# EAGLE design currentmeterProject2 (EAGLE 7.6.0)

## Sheet 1 of 2
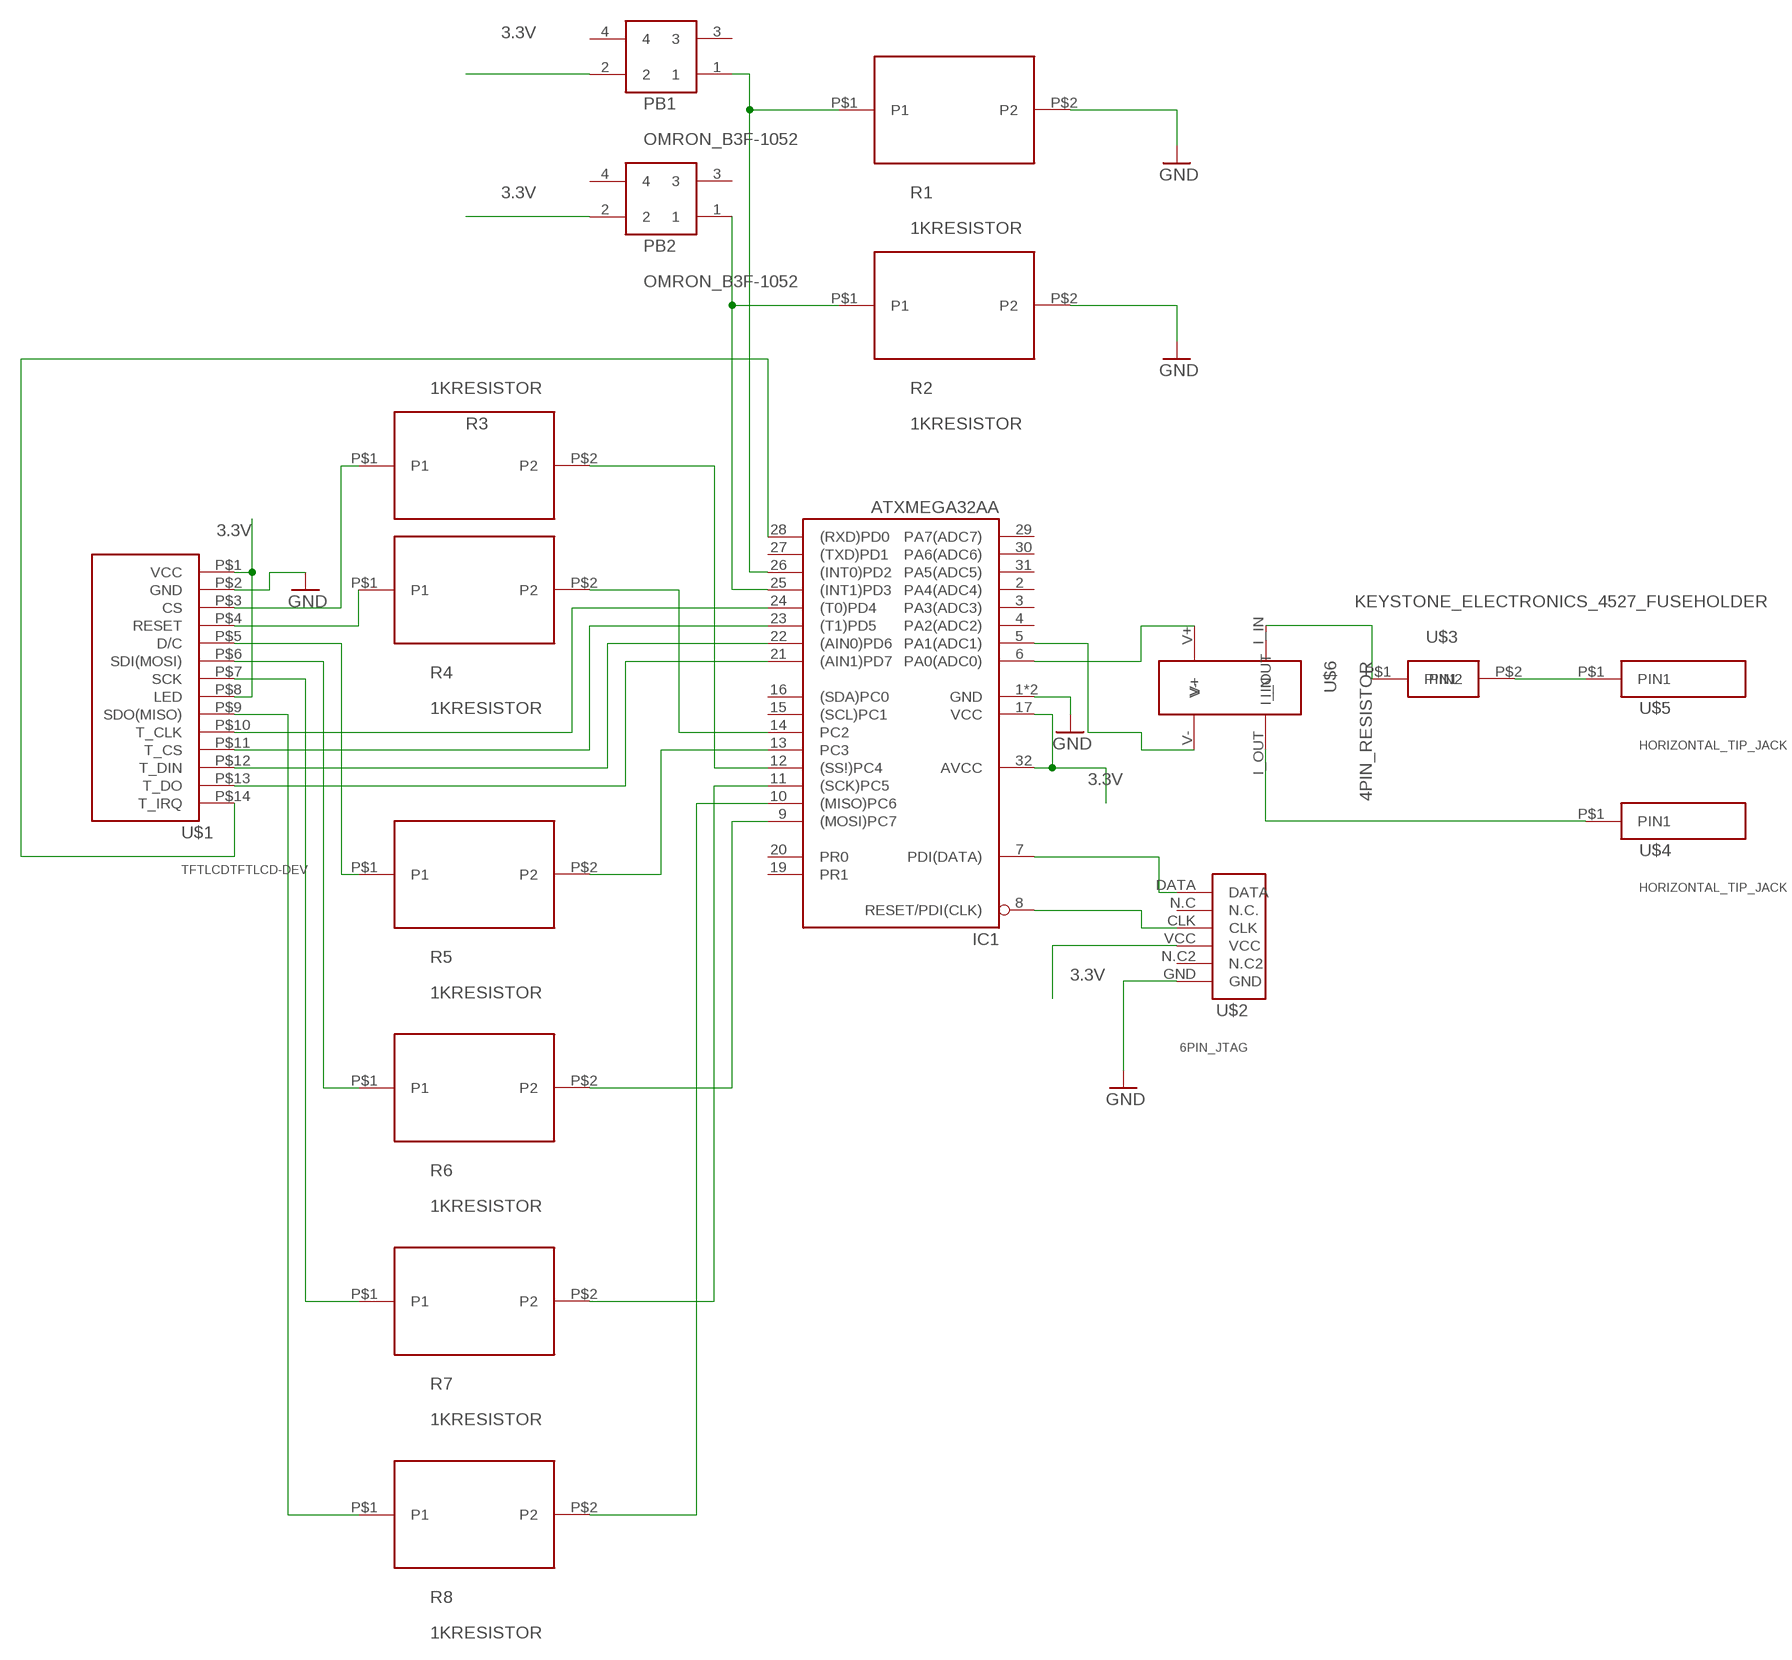
[diagram p0: schematic, sheet 1]

### Parts
IC1  ATXMEGA32AA  [TQFP32-08]
PB1  OMRON_B3F-1052  [OMRON_B3F-1052]
PB2  OMRON_B3F-1052  [OMRON_B3F-1052]
R1  1KRESISTOR  [1KRESISTOR]
R2  1KRESISTOR  [1KRESISTOR]
R3  1KRESISTOR  [1KRESISTOR]
R4  1KRESISTOR  [1KRESISTOR]
R5  1KRESISTOR  [1KRESISTOR]
R6  1KRESISTOR  [1KRESISTOR]
R7  1KRESISTOR  [1KRESISTOR]
R8  1KRESISTOR  [1KRESISTOR]
U$1  TFTLCDTFTLCD-DEV  [TFTLCDTFTLCD-DEV]
U$2  6PIN_JTAG  [6PIN_JTAG]
U$3  KEYSTONE_ELECTRONICS_4527_FUSEHOLDER  [KEYSTONE_ELECTRONICS_4527_FUSEHOLDER]
U$4  HORIZONTAL_TIP_JACK  [HORIZONTAL_TIP_JACK]
U$5  HORIZONTAL_TIP_JACK  [HORIZONTAL_TIP_JACK]
U$6  4PIN_RESISTOR  [4PIN_RESISTOR]

### Nets
3.3V: IC1.17(VCC) IC1.32(AVCC) PB1.2 PB2.2 U$1.P$1(VCC) U$1.P$8(LED) U$2.VCC ; also sheet 2
GND: IC1.1(GND) IC1.18(GND) R1.P$2(P2) R2.P$2(P2) U$1.P$2(GND) U$2.GND ; also sheet 2
N$1: IC1.5(PA1(ADC1)) U$6.V-
N$2: IC1.6(PA0(ADC0)) U$6.V+
N$3: U$3.P$1(PIN1) U$6.I_IN
N$4: U$3.P$2(PIN2) U$5.P$1(PIN1)
N$5: U$4.P$1(PIN1) U$6.I_OUT
N$6: IC1.7(PDI(DATA)) U$2.DATA
N$7: IC1.8(RESET/PDI(CLK)) U$2.CLK
N$8: IC1.12((SS!)PC4) R3.P$2(P2)
N$9: IC1.28((RXD)PD0) U$1.P$14(T_IRQ)
N$10: IC1.14(PC2) R4.P$2(P2)
N$11: IC1.13(PC3) R5.P$2(P2)
N$12: IC1.9((MOSI)PC7) R6.P$2(P2)
N$13: IC1.11((SCK)PC5) R7.P$2(P2)
N$14: IC1.10((MISO)PC6) R8.P$2(P2)
N$15: R3.P$1(P1) U$1.P$3(CS)
N$16: R4.P$1(P1) U$1.P$4(RESET)
N$17: R5.P$1(P1) U$1.P$5(D/C)
N$18: R6.P$1(P1) U$1.P$6(SDI(MOSI))
N$19: R7.P$1(P1) U$1.P$7(SCK)
N$20: R8.P$1(P1) U$1.P$9(SDO(MISO))
N$21: IC1.24((T0)PD4) U$1.P$10(T_CLK)
N$22: IC1.23((T1)PD5) U$1.P$11(T_CS)
N$23: IC1.22((AIN0)PD6) U$1.P$12(T_DIN)
N$24: IC1.21((AIN1)PD7) U$1.P$13(T_DO)
N$25: IC1.25((INT1)PD3) PB2.1 R2.P$1(P1)
N$26: IC1.26((INT0)PD2) PB1.1 R1.P$1(P1)
Unconnected: IC1.2(PA4(ADC4)) IC1.3(PA3(ADC3)) IC1.4(PA2(ADC2)) IC1.15((SCL)PC1) IC1.16((SDA)PC0) IC1.19(PR1) IC1.20(PR0) IC1.27((TXD)PD1) IC1.29(PA7(ADC7)) IC1.30(PA6(ADC6)) IC1.31(PA5(ADC5)) PB1.3 PB1.4 PB2.3 PB2.4 U$2.N.C2 U$2.N.C(N.C.)

## Sheet 2 of 2
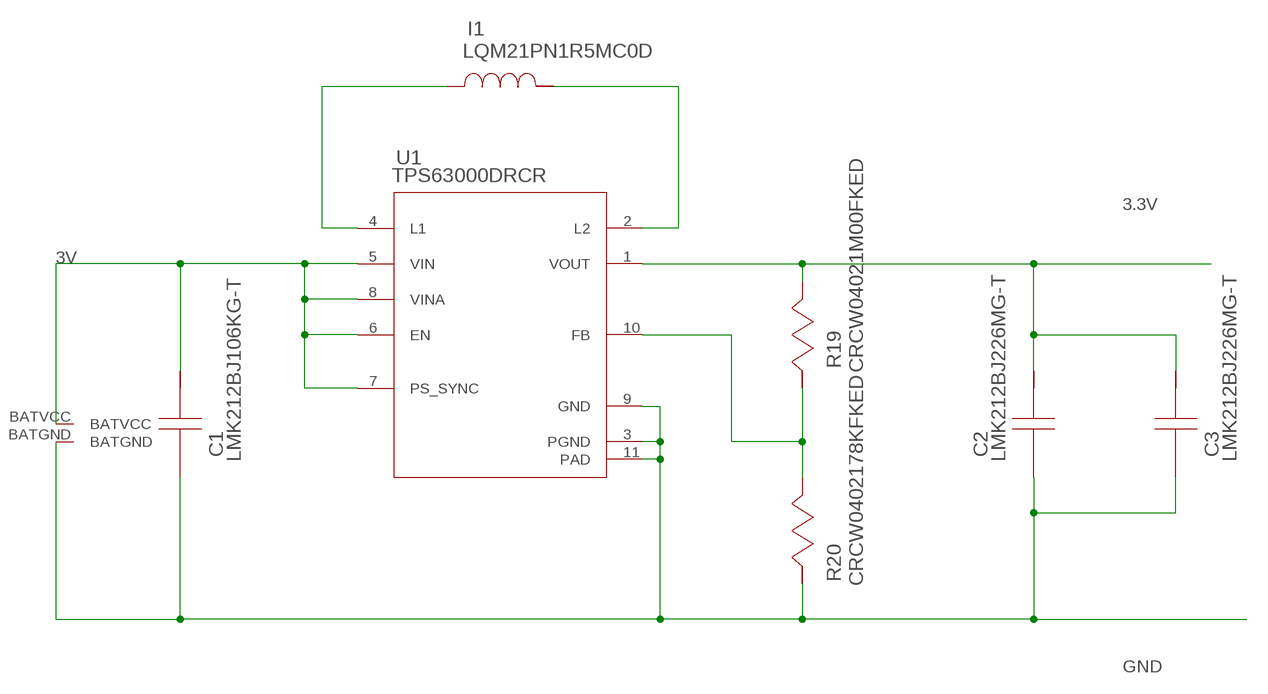
[diagram p1: schematic, sheet 2]

### Parts
C1  LMK212BJ106KG-T  [0805]
C2  LMK212BJ226MG-T  [0805]
C3  LMK212BJ226MG-T  [0805]
I1  LQM21PN1R5MC0D  [0805]
R19  CRCW04021M00FKED  [0402]
R20  CRCW0402178KFKED  [0402]
U1  TPS63000DRCR  [DRC0010J]
U$12  BATTERYHOLDER  [BATTERYHOLDER]

### Nets
3.3V: C2.1 C3.1 R19.1 U1.1(VOUT) ; also sheet 1
3V: C1.1 U1.5(VIN) U1.6(EN) U1.7(PS_SYNC) U1.8(VINA) U$12.BATVCC
GND: C1.2 C2.2 C3.2 R20.2 U1.3(PGND) U1.9(GND) U1.11(PAD) U$12.BATGND ; also sheet 1
N$56: I1.1 U1.4(L1)
N$57: I1.2 U1.2(L2)
N$58: R19.2 R20.1 U1.10(FB)

## Library data of the parts
C1 = 00ese323:LMK212BJ106KG-T; MANUFACTURER_NAME: Taiyo Yuden; VENDOR: Taiyo Yuden
C2 C3 = 00ese323:LMK212BJ226MG-T; MANUFACTURER_NAME: Taiyo Yuden; VENDOR: Taiyo Yuden
I1 = 00ese323:LQM21PN1R5MC0D; MANUFACTURER_NAME: MuRata; VENDOR: MuRata
IC1 = Tft_lcd_header:ATXMEGA32A: MICROCONTROLLER 2 Kbytes FLASH 128 bytes SRAM 128 bytes EEPROM UART 6-channel 10-bit ADC; OC_FARNELL: unknown; OC_NEWARK: unknown
PB1 PB2 = SPSTSwitch:OMRON_B3F-1052
R1-R8 = 1KRESISTOR:1KRESISTOR
R19 = 00ese323:CRCW04021M00FKED; MANUFACTURER_NAME: Vishay-Dale; VENDOR: Vishay-Dale
R20 = 00ese323:CRCW0402178KFKED; MANUFACTURER_NAME: Vishay-Dale; VENDOR: Vishay-Dale
U1 = 00ese323:TPS63000DRCR; MANUFACTURER_NAME: Texas Instruments; MANUFACTURER_PART_NUMBER: TPS63000DRCR
U$1 = 14pinheader:TFTLCDTFTLCD-DEV
U$2 = Jtagheader:6PIN_JTAG
U$3 = fuseholder:KEYSTONE_ELECTRONICS_4527_FUSEHOLDER
U$4 U$5 = tipjack:HORIZONTAL_TIP_JACK
U$6 = SHUNTRESISTOR:4PIN_RESISTOR
U$12 = 00ese323:BATTERYHOLDER

## Board
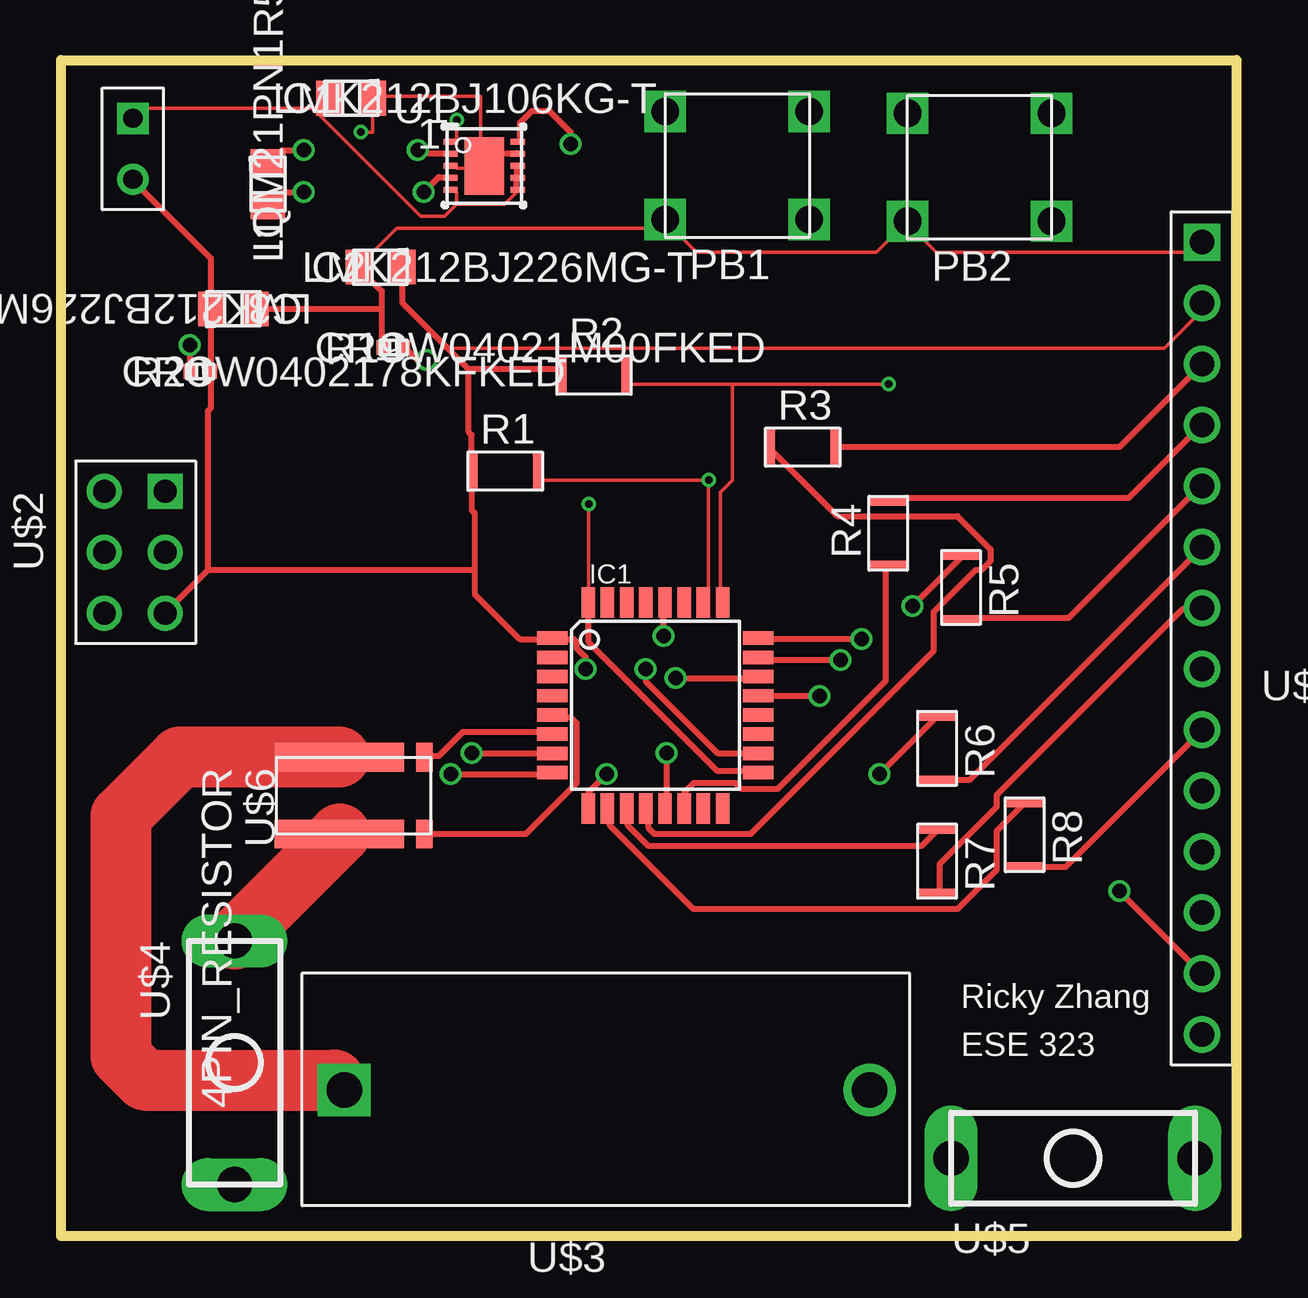
[diagram p2: board, top side]
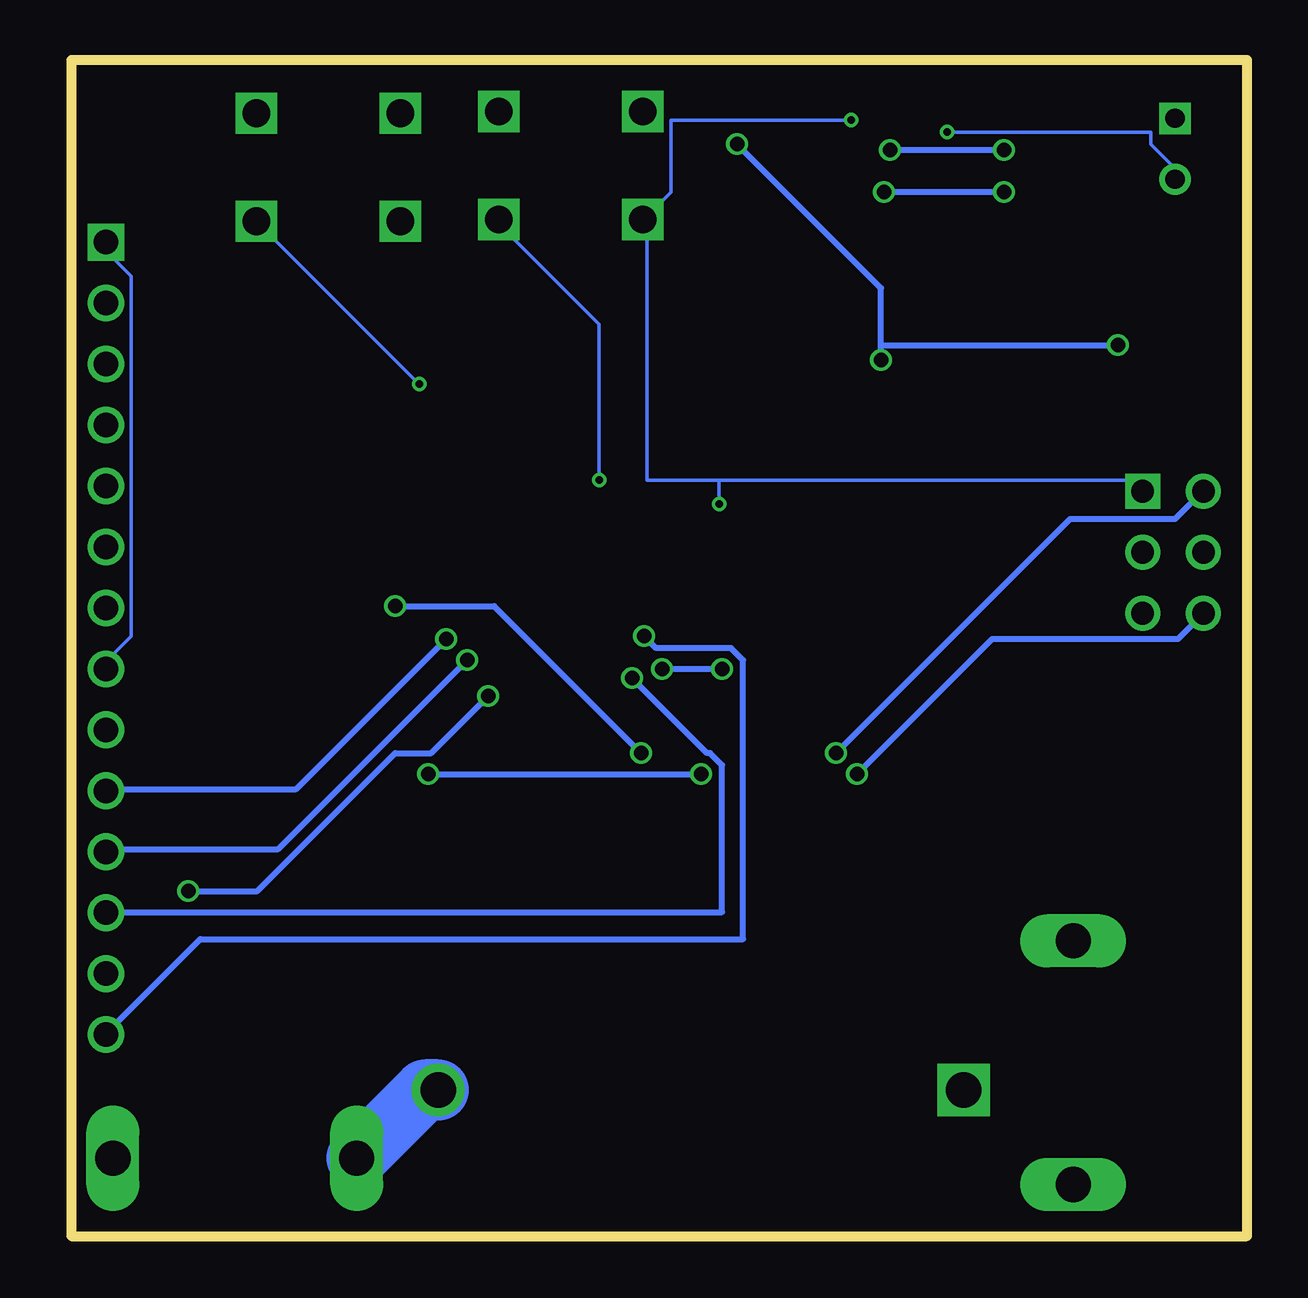
[diagram p3: board, bottom side, seen from below]

Size 49 x 49 mm. Coordinates in mm from the lower left corner, seen from the top.
Outline: 0,49 49,49 49,0 0,0 0,49
Copper layers (1*16): Top 0.035mm / dielectric 1.5mm / Bottom 0.035mm
Design rules "SeeedStudio_2layer_DRU_no_angle_20140221": minimum track width 6mil, minimum drill 12mil, track to track 6mil, track to pad 6mil, pad to pad 6mil, via to via 6mil, smd to smd 0mil, copper to edge 10mil, drill to drill 10mil, minimum pad ring 10mil, minimum via ring 6mil, stop-mask expansion 2mil, vias tented up to drill 100mil, thermal gap 10mil

### Footprints (pad centres in the part's own frame; a part is rotated, then mirrored left to right if it is on the bottom)
0805 = smd 1.118 x 1.448: 1 -0.902,0; 2 0.902,0
TQFP32-08 = smd 1.27 x 0.559: 1 -4.293,2.8; 2 -4.293,2; 3 -4.293,1.2; 4 -4.293,0.4; 5 -4.293,-0.4; 6 -4.293,-1.2; 7 -4.293,-2; 8 -4.293,-2.8; 17 4.293,-2.8; 18 4.293,-2; 19 4.293,-1.2; 20 4.293,-0.4; 21 4.293,0.4; 22 4.293,1.2; 23 4.293,2; 24 4.293,2.8 | smd 0.559 x 1.27: 9 -2.8,-4.293; 10 -2,-4.293; 11 -1.2,-4.293; 12 -0.4,-4.293; 13 0.4,-4.293; 14 1.2,-4.293; 15 2,-4.293; 16 2.8,-4.293; 25 2.8,4.293; 26 2,4.293; 27 1.2,4.293; 28 0.4,4.293; 29 -0.4,4.293; 30 -1.2,4.293; 31 -2,4.293; 32 -2.8,4.293
OMRON_B3F-1052 = drill 1.15 square: 1 6,-4.5; 2 0,-4.5; 3 6,0; 4 0,0
1KRESISTOR = smd 0.4 x 1.6: P$1 0,0; P$2 2.7,0
0402 = smd 0.559 x 0.61: 1 -0.419,0; 2 0.419,0
DRC0010J = smd 0.6 x 0.24: 1 -1.4,1; 2 -1.4,0.5; 3 -1.4,0; 4 -1.4,-0.5; 5 -1.4,-1; 6 1.4,-1; 7 1.4,-0.5; 8 1.4,0; 9 1.4,0.5; 10 1.4,1 | smd 1.65 x 2.4: 11 0,0
TFTLCDTFTLCD-DEV = drill 1.02 square: P$1 -12.7,20.32 | drill 1.02: P$2 -12.7,17.78; P$3 -12.7,15.24; P$4 -12.7,12.7; P$5 -12.7,10.16; P$6 -12.7,7.62; P$7 -12.7,5.08; P$8 -12.7,2.54; P$9 -12.7,0; P$10 -12.7,-2.54; P$11 -12.7,-5.08; P$12 -12.7,-7.62; P$13 -12.7,-10.16; P$14 -12.7,-12.7
6PIN_JTAG = drill 0.95: CLK 2.54,0; DATA -2.54,0; GND 2.54,2.54; N.C 0,2.54; N.C2 0,0 | drill 0.95 square: VCC -2.54,2.54
KEYSTONE_ELECTRONICS_4527_FUSEHOLDER = drill 1.47 square: P$1 0,-0.025 | drill 1.47: P$2 21.9,-0.025
HORIZONTAL_TIP_JACK = drill 1.471 long: P$1 0,0; P$2 10.16,0
4PIN_RESISTOR = smd 1.2 x 5.4: I_IN 0.55,-3.9; I_OUT 3.75,-3.9 | smd 1.2 x 0.7: V+ 0.55,-0.35; V- 3.75,-0.35
BATTERYHOLDER = drill 0.8: BATGND 0,-1.27 | drill 0.8 square: BATVCC 0,1.27

### Placement (x,y rotation side)
C1  12.1,47.41 0 top
C2  13.32,40.37 0 top
C3  7.19,38.63 180 top
I1  8.63,43.83 90 top
IC1  24.78,22.11 0 top
PB1  25.19,46.85 0 top
PB2  35.29,46.78 0 top
R1  19.87,31.87 180 top
R2  23.57,35.87 180 top
R3  32.27,32.87 180 top
R4  34.48,30.63 270 top
R5  37.52,25.67 90 top
R6  36.52,18.97 90 top
R7  36.52,14.27 90 top
R8  40.17,15.37 90 top
R19  13.86,37.02 0 top
R20  5.81,36.02 0 top
U1  17.64,44.59 0 top
U$1  60.26,21.09 0 top
U$2  1.81,28.49 270 top
U$3  11.81,6.11 0 top
U$4  7.24,12.3 270 top
U$5  37.11,3.24 0 top
U$6  15.5,20.5 270 top
U$12  3,45.3 0 top

### Tracks (layer width: path | path; a pad name or v marks a point on that pad's centre or on a via)
3.3V  (via drill 0.3)
  Top 0.152: U$1.P$1 47.5,41 36.5,41 35.5,42 PB2.2 35,42 34,41 26.5,41 25.5,42 PB1.2 25,42 14,42 12.5,40.5 C2.1 | v16.5,46.5 16.5,45.5 U1.1 | v22,30.5 22,26.5 IC1.32
  Top 0.254: IC1.32 22,26.38 22,24.75 27.38,19.38 29,19.38 IC1.17 | 13.38,38.62 13.38,39.38 12.5,40.25 C2.1 | 13.38,38.62 13.38,37.12 R19.1 | 13.38,38.62 8.12,38.62 C3.1
  Bottom 0.152: U$1.P$8 47.5,24 46.5,25 46.5,40 47.5,41 U$1.P$1 | v16.5,46.5 24,46.5 24,43.5 25,42.5 PB1.2 25,42 25,31.5 22,31.5 | 22,31.5 4.5,31.5 U$2.VCC | 22,31.5 v22,30.5
3V
  Top 0.152: 16.5,43 16.5,43.5 U1.5 | 16.5,43 18.5,43 19,43.5 U1.6 | 10.5,47 3,47 U$12.BATVCC | 10.5,47 11,47 C1.1 | 16.5,43 16,42.5 15,42.5 10.5,47
  Top 0.254: U1.8 19,44.5 19,44.12 U1.7 19,44 19,43.62 U1.6
GND  (via drill 0.3, 0.61)
  Top 0.152: U1.3 16.5,44.5 17.5,44.5 U1.11 17.5,45 17.5,47.5 13.5,47.5 C1.2 13,47 13,46 v12.5,46 | U$1.P$2 47.5,38.5 46,37 16,37 16.06,37.06
  Top 0.254: U$12.BATGND 3,44 6.25,40.75 6.25,38.75 C3.2 6.25,38.62 6.25,36.12 R20.2 6.25,36 6.25,34.5 6.12,34.38 6.12,27.75 | 6.12,27.75 4.38,26 U$2.GND | 17.25,27.75 17.25,30.12 17.12,30.25 17.12,31.75 R1.P$2 17.12,31.88 17.12,33.38 17,33.5 17,36.12 | 17.25,27.75 17.25,26.75 19.12,24.88 20.38,24.88 IC1.1 20.5,24.88 21.38,24.88 21.5,24.75 21.5,24.5 21.88,24.12 v21.88,23.62 | v24.38,23.62 24.38,23.12 27.38,20.12 29,20.12 IC1.18 | 17,36.12 16.06,37.06 14.25,38.88 14.25,40.25 C2.2 | U1.9 19,45.12 17.62,45.12 17.62,44.62 U1.11 | 17,36.12 20.75,36.12 R2.P$2 | 17.25,27.75 6.12,27.75
  Bottom 0.152: v12.5,46 4,46 4,45.5 3,44.5 U$12.BATGND
  Bottom 0.254: v21.88,23.62 v24.38,23.62
N$1
  Top 0.254: U$6.V- 19.38,16.75 21.5,18.88 21.5,21.38 21.25,21.62 20.5,21.62 IC1.5
N$2
  Top 0.254: U$6.V+ 15.25,20 15.75,20 16.75,21 20.38,21 IC1.6
N$3
  Top 0.406: 11.39,6.5 U$3.P$1
  Top 2.54: U$6.I_IN 4.95,19.95 2.5,17.5 2.5,7.5 3.5,6.5 11.39,6.5
N$4
  Bottom 2.54: U$3.P$2 34.27,6.08 U$5.P$1
N$5
  Top 0.254: 7.25,12.38 U$4.P$1 | 11.62,16.75 U$6.I_OUT
  Top 2.54: 11.62,16.75 7.25,12.38
N$6  (via drill 0.61)
  Top 0.254: v17.12,20.12 20.38,20.12 IC1.7
  Bottom 0.254: v17.12,20.12 7.38,29.88 3,29.88 1.88,31 U$2.DATA
N$7  (via drill 0.61)
  Top 0.254: v16.25,19.25 20.38,19.25 IC1.8
  Bottom 0.254: v16.25,19.25 10.62,24.88 2.88,24.88 1.88,25.88 U$2.CLK
N$8
  Top 0.254: IC1.12 24.5,17.75 24.5,17 24.75,16.75 28.75,16.75 36.38,24.38 36.38,26 38.12,27.75 38.38,27.75 38.75,28.12 38.75,28.62 37.38,30 32.38,30 29.62,32.75 R3.P$2
N$9  (via drill 0.61)
  Top 0.254: v25.12,25 25.12,26.38 IC1.28
  Bottom 0.254: v25.12,25 24.62,24.5 21.5,24.5 21,24 21,12.38 43.62,12.38 47.5,8.5 U$1.P$14
N$10
  Top 0.254: IC1.14 26,17.88 26,18.5 26.38,18.88 28.12,18.88 28.38,18.62 29.88,18.62 34.38,23.12 34.38,27.88 R4.P$2
N$11  (via drill 0.61)
  Top 0.254: v25.25,20.12 25.25,17.88 IC1.13 | v35.5,26.25 37.5,28.25 R5.P$2
  Bottom 0.254: v25.25,20.12 31.38,26.25 v35.5,26.25
N$12  (via drill 0.61)
  Top 0.254: v22.75,19.25 22,18.5 22,17.88 IC1.9 | v34.12,19.25 36.5,21.62 R6.P$2
  Bottom 0.254: v34.12,19.25 v22.75,19.25
N$13
  Top 0.254: IC1.11 23.62,17.75 23.62,17.12 24.5,16.25 35.88,16.25 36.5,16.88 R7.P$2
N$14
  Top 0.254: IC1.10 22.88,17.75 22.88,17.12 26.38,13.62 37.38,13.62 39,15.25 39,16.88 40.12,18 R8.P$2
N$15
  Top 0.254: R3.P$1 32.38,32.88 44.12,32.88 47.5,36.25 U$1.P$3
N$16
  Top 0.254: R4.P$1 34.5,30.75 44.5,30.75 47.5,33.75 U$1.P$4
N$17
  Top 0.254: R5.P$1 37.62,25.75 42,25.75 47.5,31.25 U$1.P$5
N$18
  Top 0.254: R6.P$1 36.62,19 37.88,19 47.5,28.62 U$1.P$6
N$19
  Top 0.254: R7.P$1 36.62,14.38 36.62,15.5 39,17.88 39,18.38 46.75,26.12 47.5,26.12 U$1.P$7
N$20
  Top 0.254: R8.P$1 40.25,15.38 41.88,15.38 47.5,21 U$1.P$9
N$21  (via drill 0.61)
  Top 0.254: v33.38,24.88 29.12,24.88 IC1.24
  Bottom 0.254: v33.38,24.88 39.62,18.62 47.5,18.62 U$1.P$10
N$22  (via drill 0.61)
  Top 0.254: v32.5,24 29.12,24 IC1.23
  Bottom 0.254: v32.5,24 40.38,16.12 47.5,16.12 U$1.P$11
N$23  (via drill 0.61)
  Top 0.254: v25.62,23.25 29,23.25 IC1.22
  Bottom 0.254: v25.62,23.25 22.5,20.12 22.38,20.12 21.88,19.62 21.88,13.5 47.5,13.5 U$1.P$12
N$24  (via drill 0.61)
  Top 0.254: v31.62,22.5 29.12,22.5 IC1.21 | v44.12,14.38 47.5,11 U$1.P$13
  Bottom 0.254: v31.62,22.5 34,20.12 35.5,20.12 41.25,14.38 v44.12,14.38
N$25  (via drill 0.3)
  Top 0.152: 28,35.5 28,31.5 27.5,31 27.5,26.5 IC1.25 | 28,35.5 23.5,35.5 R2.P$1 | 28,35.5 v34.5,35.5
  Bottom 0.152: v34.5,35.5 41,42 PB2.1
N$26  (via drill 0.3)
  Top 0.152: IC1.26 27,26.5 v27,31.5 20,31.5 R1.P$1
  Bottom 0.152: v27,31.5 27,38 31,42 PB1.1
N$56  (via drill 0.61)
  Top 0.254: v15.12,43.5 15.75,44.12 16.12,44.12 U1.4 | v10.12,43.5 9.25,43.5 8.75,43 I1.1
  Bottom 0.254: v10.12,43.5 v15.12,43.5
N$57  (via drill 0.61)
  Top 0.254: v14.88,45.25 15,45.12 16.12,45.12 U1.2 | v10.12,45.25 9.25,45.25 8.75,44.75 I1.2
  Bottom 0.254: v10.12,45.25 v14.88,45.25
N$58  (via drill 0.61)
  Top 0.254: v21.25,45.5 21.25,46 20.38,46.88 19.62,46.88 19.12,46.38 19.12,45.62 U1.10 | v15.25,36.5 14.88,36.5 14.38,37 R19.2 | v5.38,37.12 5.38,36.12 R20.1
  Bottom 0.254: v21.25,45.5 15.25,39.5 15.25,37.12 | v15.25,36.5 15.25,37.12 | 15.25,37.12 v5.38,37.12

### Text on the board
tNames: Ricky Zhang | ESE 323